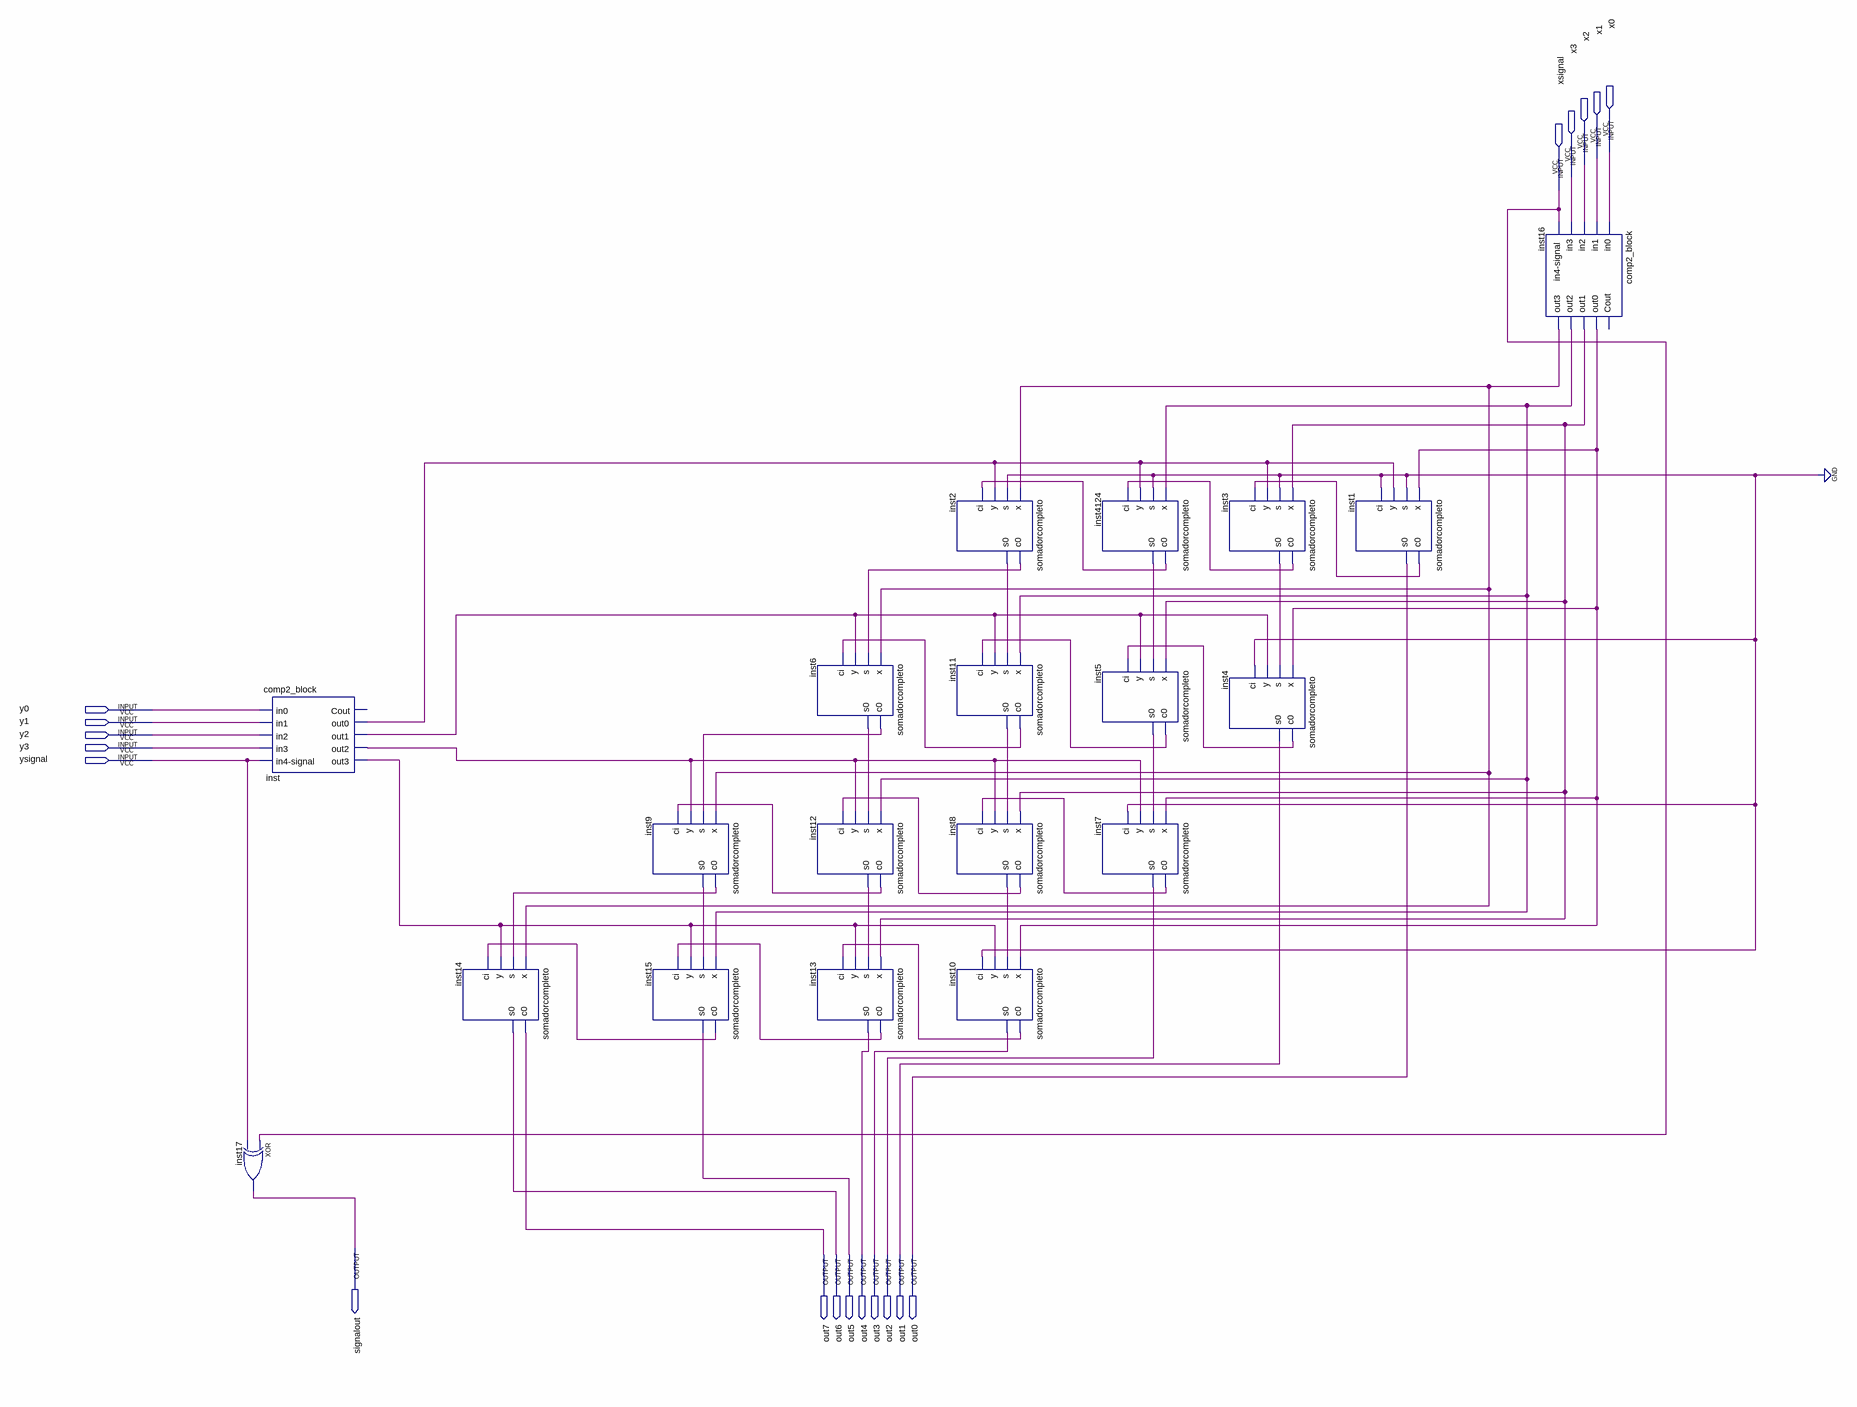
[diagram p0: schematic sheet]
// Quartus schematic multiplicador.bdf as structural Verilog: 19 symbols, 19 pins
module multiplicador (
  input  x0,
  input  x1,
  input  x2,
  input  x3,
  input  xsignal,
  input  y0,
  input  y1,
  input  y2,
  input  y3,
  input  ysignal,
  output signalout,
  output out7,
  output out6,
  output out5,
  output out4,
  output out3,
  output out2,
  output out1,
  output out0
);

  wire inst1_c0, inst2_c0, inst2_s0, inst3_c0, inst3_s0, inst4_c0, inst5_c0, inst5_s0, inst6_c0, inst6_s0,
       inst7_c0, inst8_c0, inst8_s0, inst9_c0, inst9_s0, inst10_c0, inst11_c0, inst11_s0, inst12_c0,
       inst12_s0, inst13_c0, inst15_c0, inst16_out0, inst16_out1, inst16_out2, inst16_out3, inst4124_c0,
       inst4124_s0, inst_out0, inst_out1, inst_out2, inst_out3;

  comp2_block inst (
    .in0(y0), .in1(y1), .in2(y2), .in3(y3), .\in4-signal (ysignal), .out0(inst_out0), .out1(inst_out1),
    .out2(inst_out2), .out3(inst_out3));  // open: Cout
  xor inst17 (signalout, xsignal, ysignal);
  somadorcompleto inst14 (.x(inst16_out3), .s(inst9_c0), .y(inst_out3), .ci(inst15_c0), .c0(out7), .s0(out6));
  somadorcompleto inst9 (.x(inst16_out3), .s(inst6_c0), .y(inst_out2), .ci(inst12_c0), .c0(inst9_c0), .s0(inst9_s0));
  somadorcompleto inst15 (.x(inst16_out2), .s(inst9_s0), .y(inst_out3), .ci(inst13_c0), .c0(inst15_c0), .s0(out5));
  somadorcompleto inst6 (.x(inst16_out3), .s(inst2_c0), .y(inst_out1), .ci(inst11_c0), .c0(inst6_c0), .s0(inst6_s0));
  somadorcompleto inst12 (.x(inst16_out2), .s(inst6_s0), .y(inst_out2), .ci(inst8_c0), .c0(inst12_c0), .s0(inst12_s0));
  somadorcompleto inst13 (.x(inst16_out1), .s(inst12_s0), .y(inst_out3), .ci(inst10_c0), .c0(inst13_c0), .s0(out4));
  somadorcompleto inst2 (.x(inst16_out3), .s(1'b0), .y(inst_out0), .ci(inst4124_c0), .c0(inst2_c0), .s0(inst2_s0));
  somadorcompleto inst11 (.x(inst16_out2), .s(inst2_s0), .y(inst_out1), .ci(inst5_c0), .c0(inst11_c0), .s0(inst11_s0));
  somadorcompleto inst8 (.x(inst16_out1), .s(inst11_s0), .y(inst_out2), .ci(inst7_c0), .c0(inst8_c0), .s0(inst8_s0));
  somadorcompleto inst10 (.x(inst16_out0), .s(inst8_s0), .y(inst_out3), .ci(1'b0), .c0(inst10_c0), .s0(out3));
  somadorcompleto inst4124 (
    .x(inst16_out2), .s(1'b0), .y(inst_out0), .ci(inst3_c0), .c0(inst4124_c0), .s0(inst4124_s0));
  somadorcompleto inst5 (.x(inst16_out1), .s(inst4124_s0), .y(inst_out1), .ci(inst4_c0), .c0(inst5_c0), .s0(inst5_s0));
  somadorcompleto inst7 (.x(inst16_out0), .s(inst5_s0), .y(inst_out2), .ci(1'b0), .c0(inst7_c0), .s0(out2));
  somadorcompleto inst3 (.x(inst16_out1), .s(1'b0), .y(inst_out0), .ci(inst1_c0), .c0(inst3_c0), .s0(inst3_s0));
  somadorcompleto inst4 (.x(inst16_out0), .s(inst3_s0), .y(inst_out1), .ci(1'b0), .c0(inst4_c0), .s0(out1));
  somadorcompleto inst1 (.x(inst16_out0), .s(1'b0), .y(inst_out0), .ci(1'b0), .c0(inst1_c0), .s0(out0));
  comp2_block inst16 (
    .in0(x0), .in1(x1), .in2(x2), .in3(x3), .\in4-signal (xsignal), .out0(inst16_out0), .out1(inst16_out1),
    .out2(inst16_out2), .out3(inst16_out3));  // open: Cout
endmodule
